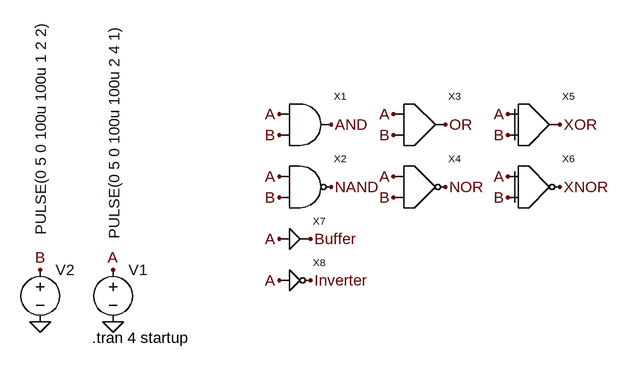
[diagram p0: schematic GatesTest.asc]
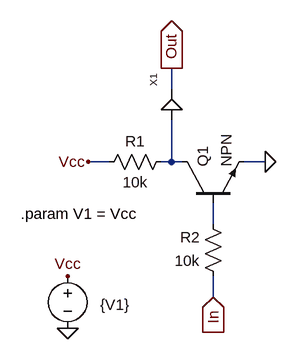
[diagram p1: sub-circuit not.asc]
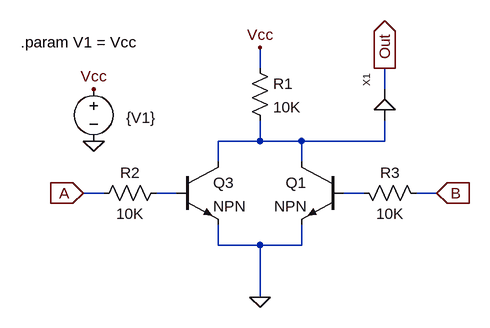
[diagram p2: sub-circuit nor.asc]
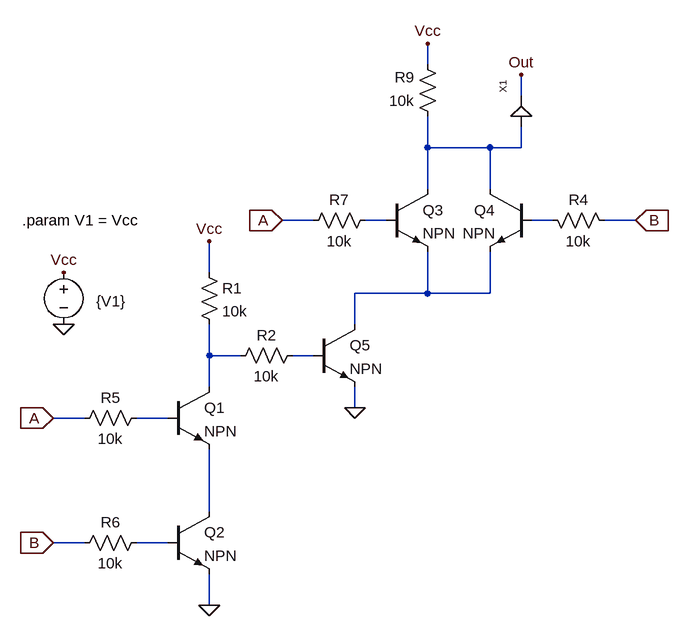
[diagram p3: sub-circuit xnor.asc]
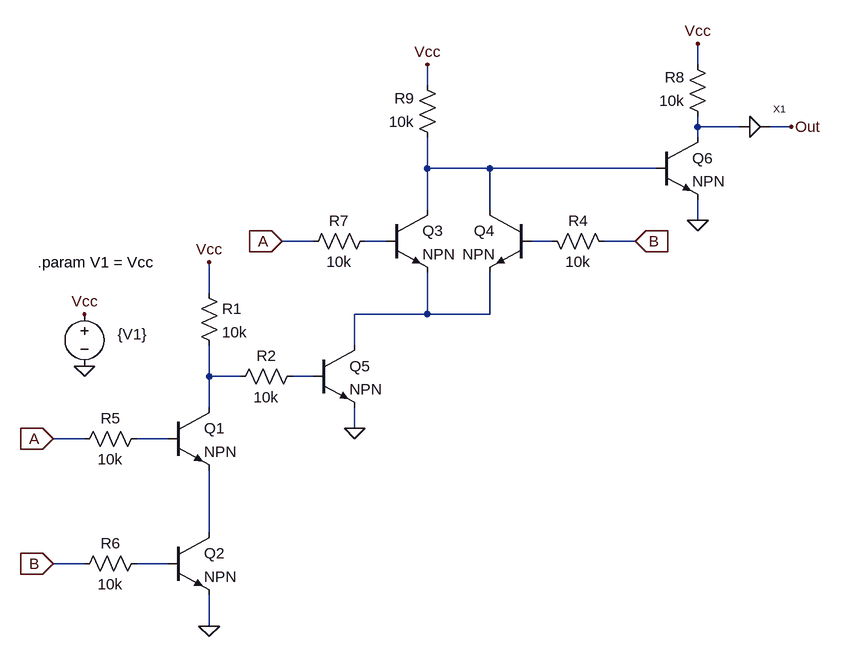
[diagram p4: sub-circuit xor.asc]
GatesTest.asc, the LTspice schematic file:
Version 4
SHEET 1 1052 680
FLAG -112 208 0
FLAG 144 -112 A
FLAG -112 128 A
FLAG 224 -96 AND
FLAG -224 208 0
FLAG -224 128 B
FLAG 144 -80 B
FLAG 144 -16 A
FLAG 320 -112 A
FLAG 320 -16 A
FLAG 496 -112 A
FLAG 496 -16 A
FLAG 144 16 B
FLAG 320 16 B
FLAG 320 -80 B
FLAG 496 -80 B
FLAG 496 16 B
FLAG 224 0 NAND
FLAG 400 -96 OR
FLAG 400 0 NOR
FLAG 576 -96 XOR
FLAG 576 0 XNOR
FLAG 192 80 Buffer
FLAG 144 80 A
FLAG 144 144 A
FLAG 192 144 Inverter
SYMBOL voltage -112 112 R0
WINDOW 3 -111 -368 VRight 2
WINDOW 123 0 0 Left 0
WINDOW 39 0 0 Left 0
SYMATTR Value PULSE(0 5 0 100u 100u 1 2 2)
SYMATTR InstName V1
SYMBOL voltage -224 112 R0
WINDOW 3 114 -362 VRight 2
WINDOW 123 0 0 Left 0
WINDOW 39 0 0 Left 0
SYMATTR Value PULSE(0 5 0 100u 100u 2 4 1)
SYMATTR InstName V2
SYMBOL AND 160 -96 R0
SYMATTR InstName X1
SYMBOL Buffer 144 80 R0
SYMATTR InstName X7
SYMBOL NAND 160 0 R0
SYMATTR InstName X2
SYMBOL NOT 144 144 R0
SYMATTR InstName X8
SYMBOL OR 320 -96 R0
SYMATTR InstName X3
SYMBOL NOR 320 0 R0
SYMATTR InstName X4
SYMBOL XNOR 496 0 R0
SYMATTR InstName X6
SYMBOL XOR 496 -96 R0
SYMATTR InstName X5
TEXT -144 232 Left 2 !.tran 4 startup

not.asc, the sub-circuit schematic file:
Version 4
SHEET 1 880 680
WIRE 112 16 112 -16
WIRE 16 128 -16 128
WIRE 112 128 112 64
WIRE 112 128 96 128
WIRE 128 128 112 128
WIRE 256 128 224 128
WIRE 176 224 176 192
WIRE 176 336 176 304
FLAG 176 336 In
IOPIN 176 336 In
FLAG 112 -16 Out
IOPIN 112 -16 Out
FLAG -48 384 0
FLAG -48 304 Vcc
FLAG -16 128 Vcc
FLAG 256 128 0
SYMBOL npn 128 192 R270
SYMATTR InstName Q1
SYMBOL res 112 112 R90
WINDOW 0 0 56 VBottom 2
WINDOW 3 32 56 VTop 2
SYMATTR InstName R1
SYMATTR Value 10k
SYMBOL res 192 320 R180
WINDOW 0 36 76 Left 2
WINDOW 3 36 40 Left 2
SYMATTR InstName R2
SYMATTR Value 10k
SYMBOL Buffer 112 64 R270
SYMATTR InstName X1
SYMBOL voltage -48 288 R0
WINDOW 0 24 16 Invisible 2
WINDOW 3 50 60 Left 2
SYMATTR InstName V1
SYMATTR Value {V1}
TEXT -120 208 Left 2 !.param V1 = Vcc

nor.asc, the sub-circuit schematic file:
Version 4
SHEET 1 880 680
WIRE 240 -80 240 -112
WIRE 432 -48 432 -80
WIRE 240 32 240 0
WIRE 240 32 176 32
WIRE 304 32 240 32
WIRE 432 32 432 0
WIRE 432 32 304 32
WIRE 176 64 176 32
WIRE 304 64 304 32
WIRE 0 112 -32 112
WIRE 112 112 80 112
WIRE 400 112 368 112
WIRE 512 112 480 112
WIRE 176 192 176 160
WIRE 240 192 176 192
WIRE 304 192 304 160
WIRE 304 192 240 192
WIRE 240 272 240 192
FLAG -32 112 A
IOPIN -32 112 In
FLAG 512 112 B
IOPIN 512 112 In
FLAG 432 -80 Out
IOPIN 432 -80 Out
FLAG 240 -112 Vcc
FLAG 240 272 0
FLAG -16 32 0
FLAG -16 -48 Vcc
SYMBOL res 224 -96 R0
SYMATTR InstName R1
SYMATTR Value 10K
SYMATTR SpiceLine tol=1 pwr=0.1
SYMBOL res 96 96 R90
WINDOW 0 0 56 VBottom 2
WINDOW 3 32 56 VTop 2
SYMATTR InstName R2
SYMATTR Value 10K
SYMATTR SpiceLine tol=1 pwr=0.1
SYMBOL res 384 96 M90
WINDOW 0 0 56 VBottom 2
WINDOW 3 32 56 VTop 2
SYMATTR InstName R3
SYMATTR Value 10K
SYMATTR SpiceLine tol=1 pwr=0.1
SYMBOL Buffer 432 0 R270
SYMATTR InstName X1
SYMBOL npn 112 64 R0
SYMATTR InstName Q3
SYMBOL npn 368 64 M0
SYMATTR InstName Q1
SYMBOL voltage -16 -64 R0
WINDOW 0 24 16 Invisible 2
WINDOW 3 50 60 Left 2
SYMATTR InstName V1
SYMATTR Value {V1}
TEXT -128 -120 Left 2 !.param V1 = Vcc

xnor.asc, the sub-circuit schematic file:
Version 4
SHEET 1 1328 680
WIRE 720 -384 720 -416
WIRE 864 -336 864 -368
WIRE 720 -256 720 -304
WIRE 816 -256 720 -256
WIRE 864 -256 864 -288
WIRE 864 -256 816 -256
WIRE 720 -192 720 -256
WIRE 816 -192 816 -256
WIRE 544 -144 496 -144
WIRE 656 -144 624 -144
WIRE 912 -144 880 -144
WIRE 1040 -144 992 -144
WIRE 384 -64 384 -112
WIRE 720 -32 720 -96
WIRE 720 -32 608 -32
WIRE 816 -32 816 -96
WIRE 816 -32 720 -32
WIRE 608 16 608 -32
WIRE 384 64 384 16
WIRE 432 64 384 64
WIRE 544 64 512 64
WIRE 384 112 384 64
WIRE 608 144 608 112
WIRE 192 160 144 160
WIRE 320 160 272 160
WIRE 384 304 384 208
WIRE 192 352 144 352
WIRE 320 352 272 352
WIRE 384 448 384 400
FLAG 496 -144 A
IOPIN 496 -144 In
FLAG 144 160 A
IOPIN 144 160 In
FLAG 144 352 B
IOPIN 144 352 In
FLAG 1040 -144 B
IOPIN 1040 -144 In
FLAG 864 -368 Out
FLAG 160 16 0
FLAG 160 -64 Vcc
FLAG 384 -112 Vcc
FLAG 720 -416 Vcc
FLAG 608 144 0
FLAG 384 448 0
SYMBOL npn 320 112 R0
SYMATTR InstName Q1
SYMBOL npn 320 304 R0
SYMATTR InstName Q2
SYMBOL npn 656 -192 R0
SYMATTR InstName Q3
SYMBOL npn 880 -192 M0
SYMATTR InstName Q4
SYMBOL npn 544 16 R0
SYMATTR InstName Q5
SYMBOL res 368 -80 R0
SYMATTR InstName R1
SYMATTR Value 10k
SYMBOL res 528 48 R90
WINDOW 0 0 56 VBottom 2
WINDOW 3 32 56 VTop 2
SYMATTR InstName R2
SYMATTR Value 10k
SYMBOL res 896 -160 M90
WINDOW 0 0 56 VBottom 2
WINDOW 3 32 56 VTop 2
SYMATTR InstName R4
SYMATTR Value 10k
SYMBOL res 288 144 R90
WINDOW 0 0 56 VBottom 2
WINDOW 3 32 56 VTop 2
SYMATTR InstName R5
SYMATTR Value 10k
SYMBOL res 288 336 R90
WINDOW 0 0 56 VBottom 2
WINDOW 3 32 56 VTop 2
SYMATTR InstName R6
SYMATTR Value 10k
SYMBOL res 640 -160 R90
WINDOW 0 0 56 VBottom 2
WINDOW 3 32 56 VTop 2
SYMATTR InstName R7
SYMATTR Value 10k
SYMBOL res 736 -288 R180
WINDOW 0 36 76 Left 2
WINDOW 3 36 40 Left 2
SYMATTR InstName R9
SYMATTR Value 10k
SYMBOL Buffer 864 -288 R270
SYMATTR InstName X1
SYMBOL voltage 160 -80 R0
WINDOW 0 24 16 Invisible 2
WINDOW 3 50 60 Left 2
SYMATTR InstName V1
SYMATTR Value {V1}
TEXT 96 -144 Left 2 !.param V1 = Vcc

xor.asc, the sub-circuit schematic file:
Version 4
SHEET 1 1388 680
WIRE 1136 -416 1136 -448
WIRE 720 -384 720 -416
WIRE 1136 -320 1136 -336
WIRE 1200 -320 1136 -320
WIRE 1280 -320 1248 -320
WIRE 1136 -304 1136 -320
WIRE 720 -256 720 -304
WIRE 816 -256 720 -256
WIRE 1072 -256 816 -256
WIRE 720 -192 720 -256
WIRE 816 -192 816 -256
WIRE 1136 -176 1136 -208
WIRE 544 -144 496 -144
WIRE 656 -144 624 -144
WIRE 912 -144 880 -144
WIRE 1040 -144 992 -144
WIRE 384 -64 384 -112
WIRE 720 -32 720 -96
WIRE 720 -32 608 -32
WIRE 816 -32 816 -96
WIRE 816 -32 720 -32
WIRE 608 16 608 -32
WIRE 384 64 384 16
WIRE 432 64 384 64
WIRE 544 64 512 64
WIRE 384 112 384 64
WIRE 608 144 608 112
WIRE 192 160 144 160
WIRE 320 160 272 160
WIRE 384 304 384 208
WIRE 192 352 144 352
WIRE 320 352 272 352
WIRE 384 448 384 400
FLAG 496 -144 A
IOPIN 496 -144 In
FLAG 144 160 A
IOPIN 144 160 In
FLAG 144 352 B
IOPIN 144 352 In
FLAG 1040 -144 B
IOPIN 1040 -144 In
FLAG 1280 -320 Out
FLAG 608 144 0
FLAG 384 448 0
FLAG 1136 -176 0
FLAG 1136 -448 Vcc
FLAG 720 -416 Vcc
FLAG 384 -112 Vcc
FLAG 192 -32 Vcc
FLAG 192 48 0
SYMBOL npn 320 112 R0
SYMATTR InstName Q1
SYMBOL npn 320 304 R0
SYMATTR InstName Q2
SYMBOL npn 656 -192 R0
SYMATTR InstName Q3
SYMBOL npn 880 -192 M0
SYMATTR InstName Q4
SYMBOL npn 544 16 R0
SYMATTR InstName Q5
SYMBOL res 368 -80 R0
SYMATTR InstName R1
SYMATTR Value 10k
SYMBOL res 528 48 R90
WINDOW 0 0 56 VBottom 2
WINDOW 3 32 56 VTop 2
SYMATTR InstName R2
SYMATTR Value 10k
SYMBOL res 896 -160 M90
WINDOW 0 0 56 VBottom 2
WINDOW 3 32 56 VTop 2
SYMATTR InstName R4
SYMATTR Value 10k
SYMBOL res 288 144 R90
WINDOW 0 0 56 VBottom 2
WINDOW 3 32 56 VTop 2
SYMATTR InstName R5
SYMATTR Value 10k
SYMBOL res 288 336 R90
WINDOW 0 0 56 VBottom 2
WINDOW 3 32 56 VTop 2
SYMATTR InstName R6
SYMATTR Value 10k
SYMBOL res 640 -160 R90
WINDOW 0 0 56 VBottom 2
WINDOW 3 32 56 VTop 2
SYMATTR InstName R7
SYMATTR Value 10k
SYMBOL res 736 -288 R180
WINDOW 0 36 76 Left 2
WINDOW 3 36 40 Left 2
SYMATTR InstName R9
SYMATTR Value 10k
SYMBOL npn 1072 -304 R0
SYMATTR InstName Q6
SYMBOL res 1152 -320 R180
WINDOW 0 36 76 Left 2
WINDOW 3 36 40 Left 2
SYMATTR InstName R8
SYMATTR Value 10k
SYMBOL Buffer 1200 -320 R0
SYMATTR InstName X1
SYMBOL voltage 192 -48 R0
WINDOW 0 24 16 Invisible 2
WINDOW 3 51 47 Left 2
SYMATTR InstName V1
SYMATTR Value {V1}
TEXT 120 -112 Left 2 !.param V1 = Vcc

The netlist it stands for:
* GatesTest.asc
V1 A 0 PULSE(0 5 0 100u 100u 1 2 2)
V2 B 0 PULSE(0 5 0 100u 100u 2 4 1)
XX1 A B AND AND Vcc = 5V  ; pins A B Out
XX7 A Buffer Buffer Vcc = 5V  ; pins In Out
XX2 A B NAND NAND Vcc = 5V  ; pins A B Out
XX8 Inverter A not params: Vcc = 5V
XX3 A B OR OR Vcc = 5V  ; pins A B Out
XX4 A B NOR nor params: Vcc = 5V
XX6 A B XNOR xnor params: Vcc = 5V
XX5 A B XOR xor params: Vcc = 5V

* block symbol definitions
.subckt not Out In
Q1 N001 N002 0 0 NPN
R1 N001 Vcc 10k
R2 In N002 10k
XX1 N001 Out Buffer Vcc = 5V  ; pins In Out
V1 Vcc 0 {V1}
.param V1 = Vcc
.ends not

.subckt nor A B Out
R1 Vcc N001 10K tol=1 pwr=0.1
R2 N002 A 10K tol=1 pwr=0.1
R3 N003 B 10K tol=1 pwr=0.1
XX1 N001 Out Buffer Vcc = 5V  ; pins In Out
Q3 N001 N002 0 0 NPN
Q1 N001 N003 0 0 NPN
V1 Vcc 0 {V1}
.param V1 = Vcc
.ends nor

.subckt xnor A B Out
Q1 N005 N007 N008 0 NPN
Q2 N008 N009 0 0 NPN
Q3 N001 N002 N004 0 NPN
Q4 N001 N003 N004 0 NPN
Q5 N004 N006 0 0 NPN
R1 Vcc N005 10k
R2 N006 N005 10k
R4 N003 B 10k
R5 N007 A 10k
R6 N009 B 10k
R7 N002 A 10k
R9 N001 Vcc 10k
XX1 N001 Out Buffer Vcc = 5V  ; pins In Out
V1 Vcc 0 {V1}
.param V1 = Vcc
.ends xnor

.subckt xor A B Out
Q1 N006 N008 N009 0 NPN
Q2 N009 N010 0 0 NPN
Q3 N002 N003 N005 0 NPN
Q4 N002 N004 N005 0 NPN
Q5 N005 N007 0 0 NPN
R1 Vcc N006 10k
R2 N007 N006 10k
R4 N004 B 10k
R5 N008 A 10k
R6 N010 B 10k
R7 N003 A 10k
R9 N002 Vcc 10k
Q6 N001 N002 0 0 NPN
R8 N001 Vcc 10k
XX1 N001 Out Buffer Vcc = 5V  ; pins In Out
V1 Vcc 0 {V1}
.param V1 = Vcc
.ends xor

.model NPN NPN
.model PNP PNP
.lib standard.bjt
.tran 4 startup
.backanno
.end